# EAGLE design Keg Cop - Devel (EAGLE 9.6.2)
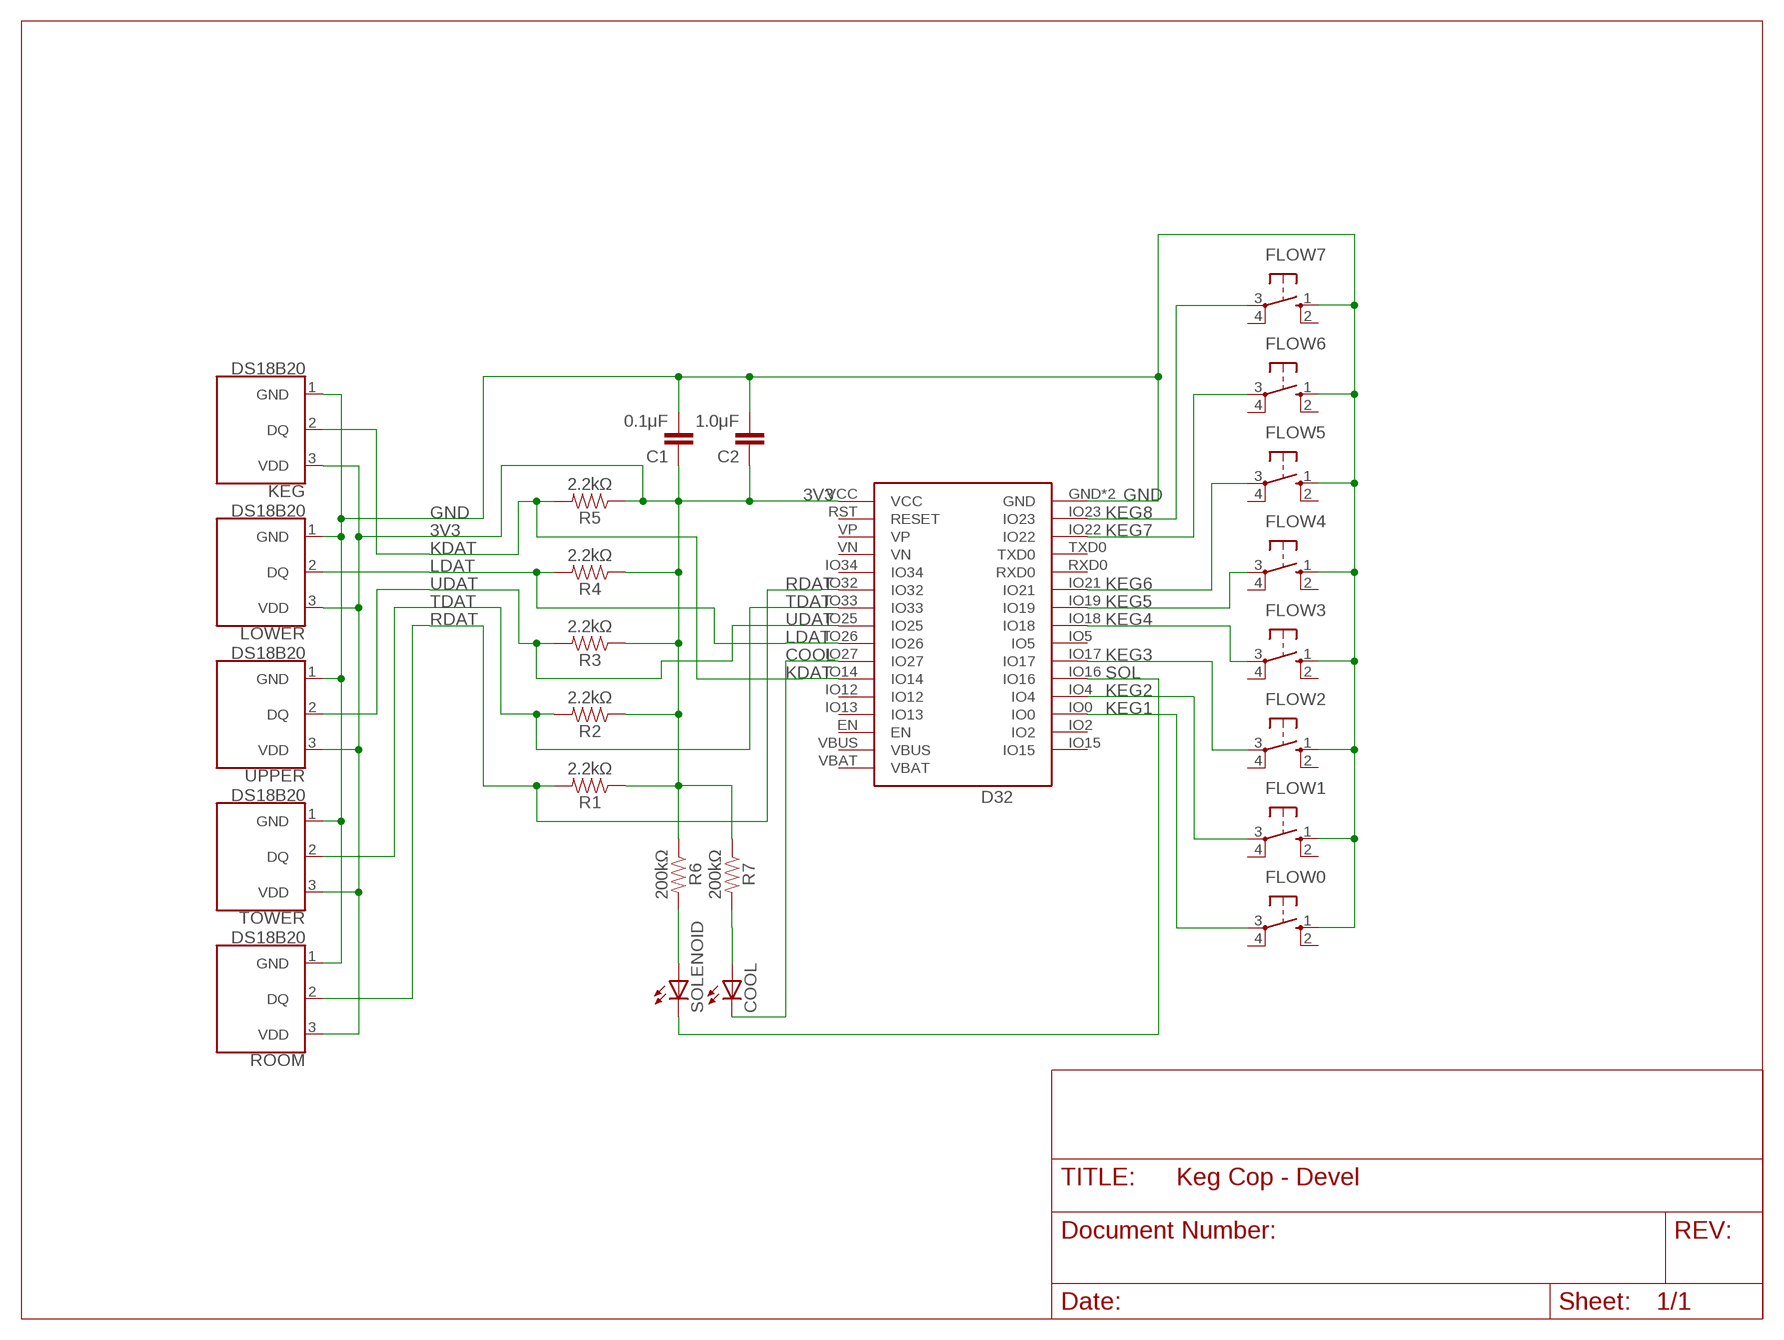
[diagram p0: schematic, sheet 1]

## Parts
C1  0.1μF  CAP_CERAMIC_2.54  [CAP_PTH-2.54]
C2  1.0μF  CAP_CERAMIC_2.54  [CAP_PTH-2.54]
COOL  LED3MM  [LED3MM]
D32  Lolin D32  WEMOS-D32D32_NO_BATT  [D32_NO_BATT]
FLOW0  10-XX  [B3F-10XX]
FLOW1  10-XX  [B3F-10XX]
FLOW2  10-XX  [B3F-10XX]
FLOW3  10-XX  [B3F-10XX]
FLOW4  10-XX  [B3F-10XX]
FLOW5  10-XX  [B3F-10XX]
FLOW6  10-XX  [B3F-10XX]
FLOW7  10-XX  [B3F-10XX]
KEG  DS18B20  [TO-92-AMMO]
LOWER  DS18B20  [TO-92-AMMO]
R1  2.2kΩ  RESISTORAXIAL-0.3  [AXIAL-0.3]
R2  2.2kΩ  RESISTORAXIAL-0.3  [AXIAL-0.3]
R3  2.2kΩ  RESISTORAXIAL-0.3  [AXIAL-0.3]
R4  2.2kΩ  RESISTORAXIAL-0.3  [AXIAL-0.3]
R5  2.2kΩ  RESISTORAXIAL-0.3  [AXIAL-0.3]
R6  200kΩ  RESISTORAXIAL-0.3  [AXIAL-0.3]
R7  200kΩ  RESISTORAXIAL-0.3  [AXIAL-0.3]
ROOM  DS18B20  [TO-92-AMMO]
SOLENOID  LED3MM  [LED3MM]
TOWER  DS18B20  [TO-92-AMMO]
UPPER  DS18B20  [TO-92-AMMO]

## Nets
3V3 [3v]: C1.1 C2.1 D32.VCC KEG.3(VDD) LOWER.3(VDD) R1.P$1 R2.P$1 R3.P$1 R4.P$1 R5.P$1 R6.P$1 R7.P$1 ROOM.3(VDD) TOWER.3(VDD) UPPER.3(VDD)
COOL: COOL.K(C) D32.IO27
GND: C1.2 C2.2 D32.GND D32.GND2(GND) FLOW0.1(S) FLOW1.1(S) FLOW2.1(S) FLOW3.1(S) FLOW4.1(S) FLOW5.1(S) FLOW6.1(S) FLOW7.1(S) KEG.1(GND) LOWER.1(GND) ROOM.1(GND) TOWER.1(GND) UPPER.1(GND)
KDAT: D32.IO14 KEG.2(DQ) R5.P$2
KEG1: D32.IO0 FLOW0.3(P)
KEG2: D32.IO4 FLOW1.3(P)
KEG3: D32.IO17 FLOW2.3(P)
KEG4: D32.IO18 FLOW3.3(P)
KEG5: D32.IO19 FLOW4.3(P)
KEG6: D32.IO21 FLOW5.3(P)
KEG7: D32.IO22 FLOW6.3(P)
KEG8: D32.IO23 FLOW7.3(P)
LDAT: D32.IO26 LOWER.2(DQ) R4.P$2
N$1: COOL.A R7.P$2
N$2: R6.P$2 SOLENOID.A
RDAT: D32.IO32 R1.P$2 ROOM.2(DQ)
SOL: D32.IO16 SOLENOID.K(C)
TDAT: D32.IO33 R2.P$2 TOWER.2(DQ)
UDAT: D32.IO25 R3.P$2 UPPER.2(DQ)
Unconnected: D32.EN D32.IO2 D32.IO5 D32.IO12 D32.IO13 D32.IO15 D32.IO34 D32.RST(RESET) D32.RXD0 D32.TXD0 D32.VBAT D32.VBUS D32.VN D32.VP FLOW0.2(S1) FLOW0.4(P1) FLOW1.2(S1) FLOW1.4(P1) FLOW2.2(S1) FLOW2.4(P1) FLOW3.2(S1) FLOW3.4(P1) FLOW4.2(S1) FLOW4.4(P1) FLOW5.2(S1) FLOW5.4(P1) FLOW6.2(S1) FLOW6.4(P1) FLOW7.2(S1) FLOW7.4(P1)

## Library data of the parts
C1 C2 = Donnie:CAP_CERAMIC_2.54
COOL SOLENOID = adafruit:LED: LED OSRAM: - CHIPLED LG R971, LG N971, LY N971, LG Q971, LY Q971, LO R971, LY R971 LH N974, LH R974 LS Q976, LO Q976, LY Q976 LO Q996 - Hyper CHIPLED LW Q18S LB Q993, LB Q99A, LB R99A - SideLED LS A670, LO A670, LY A670, LG A670, LP A670 LB A673, LV A673, LT A673, LW A673 LH A674 LY A675 LS A676, LA A676, LO A676, LY A676, LW A676 LS A679, LY A679, LG A679 - Hyper Micro SIDELED® LS Y876, LA Y876, LO Y876, LY Y876 LT Y87S - SmartLED LW L88C, LW L88S LB L89C, LB L89S, LG L890 LS L89K, LO L89K, LY L89K LS L896, LA L896, LO L896, LY L896 - TOPLED LS T670, LO T670, LY T670, LG T670, LP T670 LSG T670, LSP T670, LSY T670, LOP T670, LYG T670 LG T671, LOG T671, LSG T671 LB T673, LV T673, LT T673, LW T673 LH T674 LS T676, LA T676, LO T676, LY T676, LB T676, LH T676, LSB T676, LW T676 LB T67C, LV T67C, LT T67C, LS T67K, LO T67K, LY T67K, LW E67C LS E67B, LA E67B, LO E67B, LY E67B, LB E67C, LV E67C, LT E67C LW T67C LS T679, LY T679, LG T679 LS T770, LO T770, LY T770, LG T770, LP T770 LB T773, LV T773, LT T773, LW T773 LH T774 LS E675, LA E675, LY E675, LS T675 LS T776, LA T776, LO T776, LY T776, LB T776 LHGB T686 LT T68C, LB T68C - Hyper Mini TOPLED® LB M676 - Mini TOPLED Santana® LG M470 LS M47K, LO M47K, LY M47K Source: http://www.osram.convergy.de/
D32 = Donnie:WEMOS-D32: D32_REVERSE is a Reverse silkscreen for placing the Wemos D32 on the underside of the board D32_NO-KEEPOUT removes the keepout area beneath the antenna on the D32 and provides a note to avoid components and traces.
FLOW0 FLOW1-FLOW7 = switch-omron:10-XX: OMRON SWITCH; MPN: B3F-1000; OC_FARNELL: 176432; OC_NEWARK: 36M3542
KEG LOWER ROOM TOWER UPPER = SparkFun-Sensors:DS18B20: Dallas/Maxim DS18B20 1-Wire Temperature Sensor The DS18B20 reports degrees C with 9 to 12-bit precision, -55C to 125C (+/-0.5C). Each sensor has a unique 64-Bit Serial number etched into it - allows for a huge number of sensors to be used on one data bus. Datasheet <http://datasheets.maximintegrated.com/en/ds/DS18B20.pdf> SparkFun Products One Wire Digital Temperature Sensor - DS18B20 <https://www.sparkfun.com/products/245> (SEN-00245); STORE_ID: SEN-00245
R1-R7 = SparkFun-Resistors:RESISTOR: Generic Resistor Package

## Net classes
0 default: width 0.305 mm, clearance 0.305 mm
1 5v: width 0.406 mm, clearance 0.406 mm
2 3v: width 0.406 mm, clearance 0.406 mm

## Board
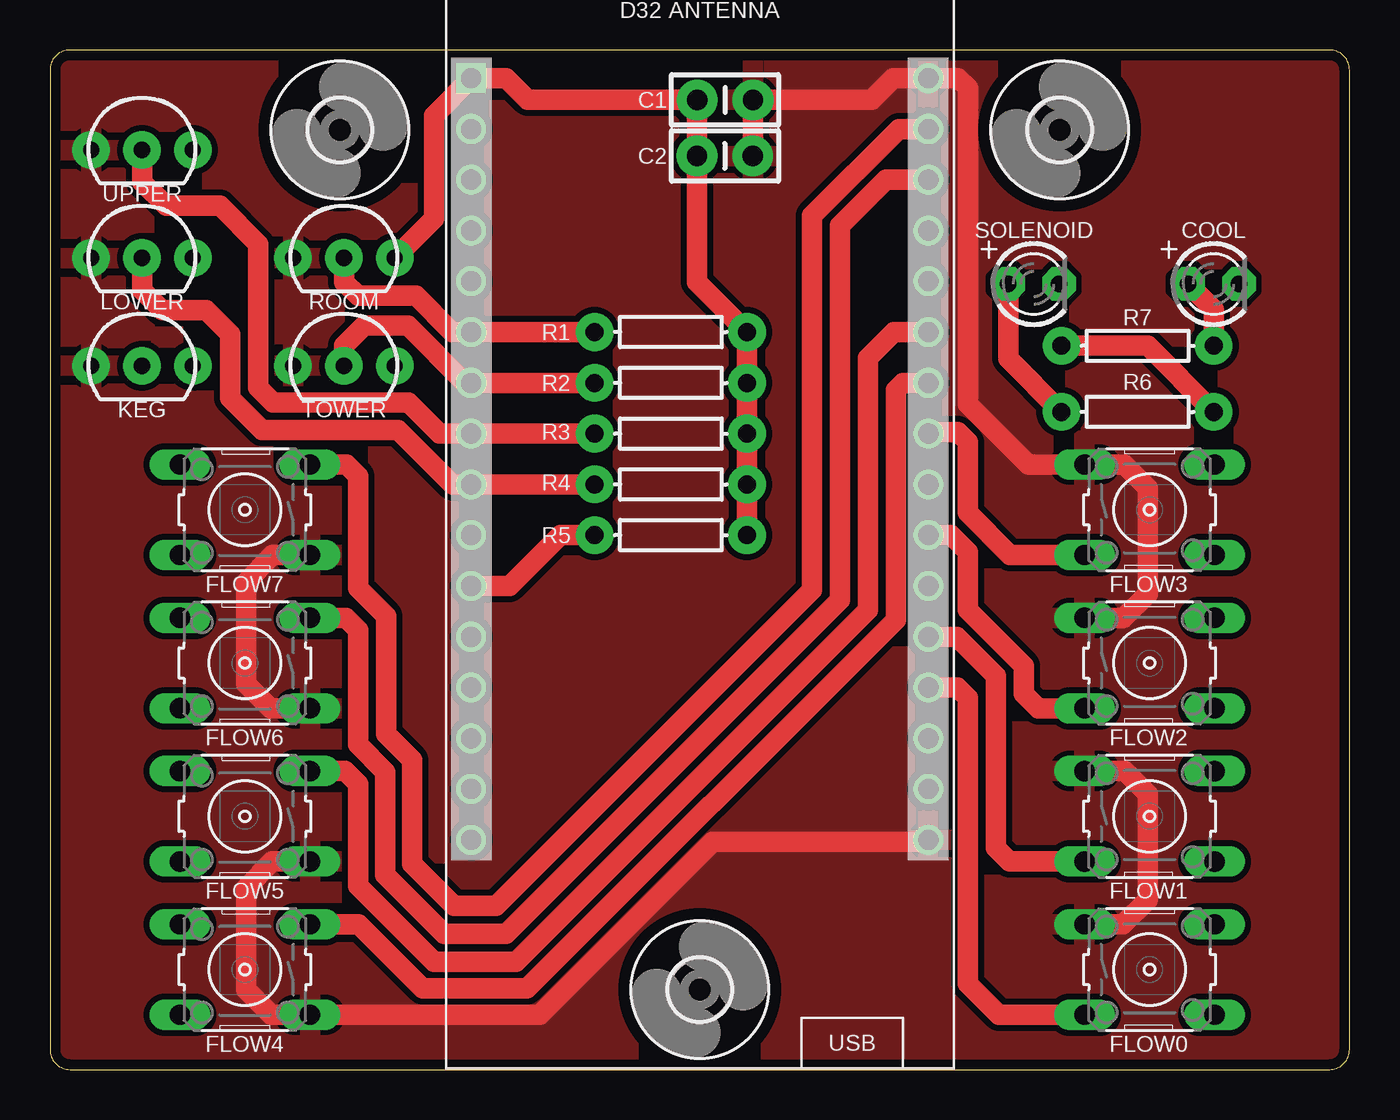
[diagram p1: board, top side]
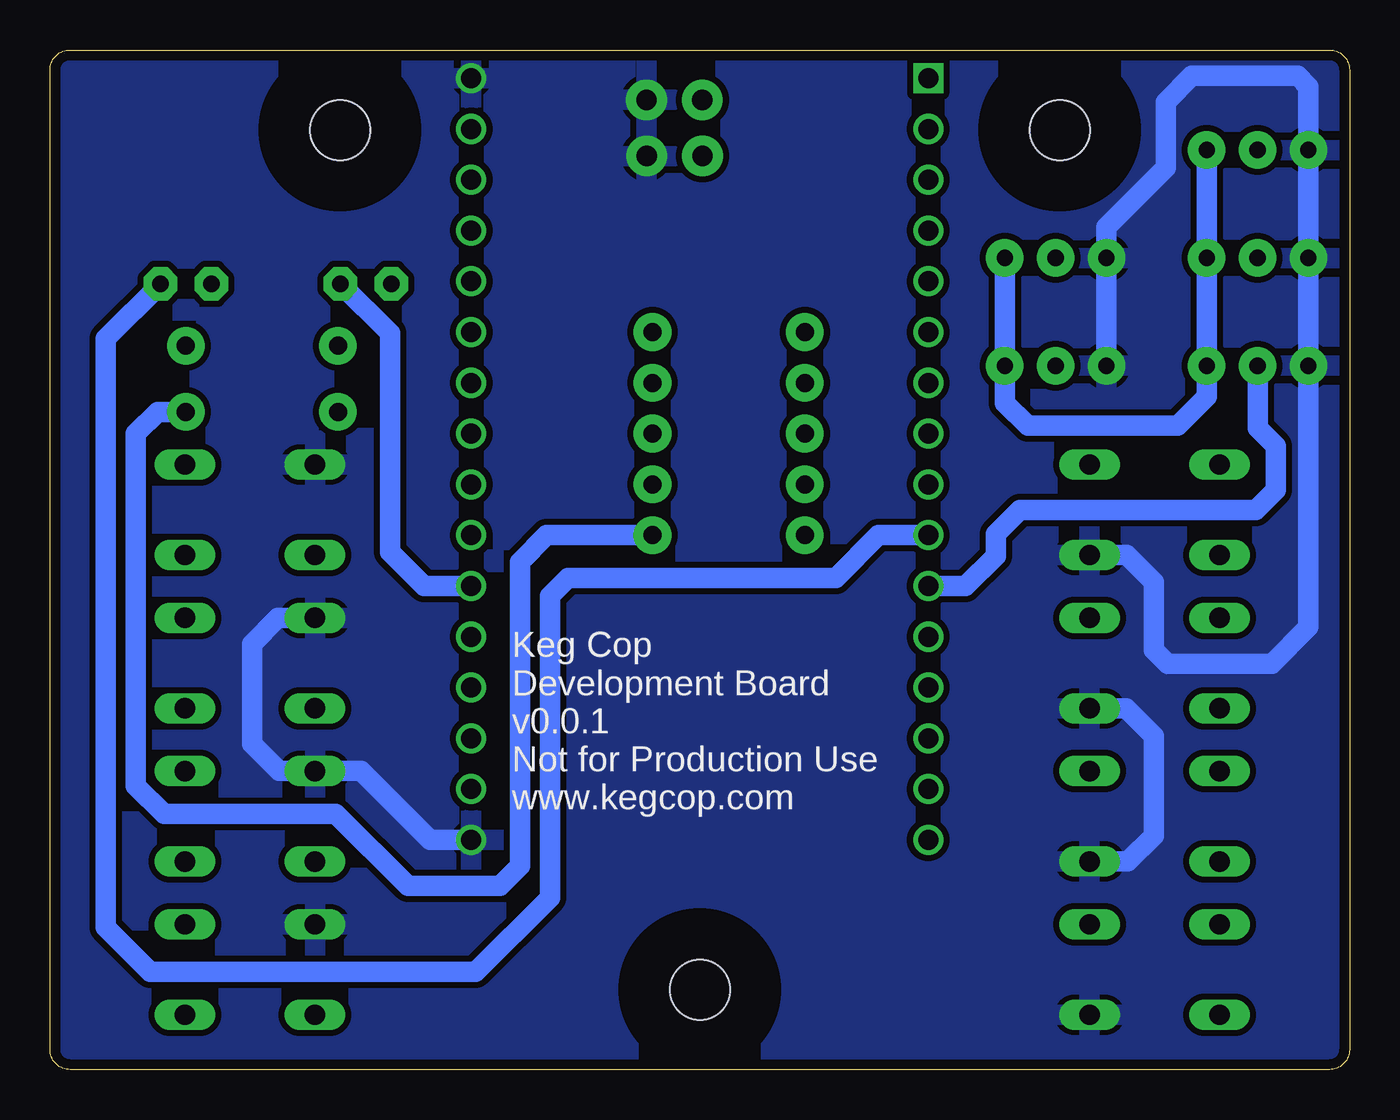
[diagram p2: board, bottom side, seen from below]

Size 65 x 51 mm. Coordinates in mm from the lower left corner, seen from the top.
Outline: 1,0 64,0 arc90 65,1 65,50 arc90 64,51 1,51 arc90 0,50 0,1 arc90 1,0
Copper layers (1*16): Top 0.035mm / dielectric 1.5mm / Bottom 0.035mm
Design rules "default *": minimum track width 6mil, minimum drill 0.35mm, track to track 6mil, track to pad 6mil, pad to pad 6mil, via to via 6mil, smd to smd 6mil, copper to edge 20mil, drill to drill 6mil, minimum pad ring 10mil, minimum via ring 8mil, stop-mask expansion 4mil, vias tented up to drill 20mil, thermal gap 10mil

### Footprints (pad centres in the part's own frame; a part is rotated, then mirrored left to right if it is on the bottom)
CAP_PTH-2.54 = drill 1.016 pad 2.032: 1 -1.397,0; 2 1.397,0
LED3MM = drill 0.813 pad 1.676 octagon: A -1.27,0; K 1.27,0
D32_NO_BATT = drill 1: EN -11.43,-12.7; GND 11.43,20.32; GND2 11.43,-17.78; IO0 11.43,-10.16; IO2 11.43,-12.7; IO4 11.43,-7.62; IO5 11.43,0; IO12 -11.43,-7.62; IO13 -11.43,-10.16; IO14 -11.43,-5.08; IO15 11.43,-15.24; IO16 11.43,-5.08; IO17 11.43,-2.54; IO18 11.43,2.54; IO19 11.43,5.08; IO21 11.43,7.62; IO22 11.43,15.24; IO23 11.43,17.78; IO25 -11.43,2.54; IO26 -11.43,0; IO27 -11.43,-2.54; IO32 -11.43,7.62; IO33 -11.43,5.08; IO34 -11.43,10.16; RST -11.43,17.78; RXD0 11.43,10.16; TXD0 11.43,12.7; VBAT -11.43,-17.78; VBUS -11.43,-15.24; VN -11.43,12.7; VP -11.43,15.24 | drill 1 square: VCC -11.43,20.32
B3F-10XX = drill 1.016 long: 1 -3.251,2.261; 2 3.251,2.261; 3 -3.251,-2.261; 4 3.251,-2.261
TO-92-AMMO = drill 0.813 pad 1.88: 1 -2.54,0; 2 0,0; 3 2.54,0
AXIAL-0.3 = drill 0.9 pad 1.88: P$1 -3.81,0; P$2 3.81,0
3,0 = hole 3: 0,0

### Placement (x,y rotation side)
C1  33.77,48.5 0 top
C2  33.76,45.7 0 top
COOL  58.2,39.3 0 top
D32  32.5,29.27 0 top
FLOW0  55,5 0 top
FLOW1  55,12.67 0 top
FLOW2  55,20.33 0 top
FLOW3  55,28 0 top
FLOW4  9.75,5 180 top
FLOW5  9.75,12.67 180 top
FLOW6  9.75,20.33 180 top
FLOW7  9.75,28 180 top
KEG  4.6,35.2 0 top
LOWER  4.6,40.6 0 top
R1  31.05,36.89 180 top
R2  31.05,34.35 180 top
R3  31.05,31.81 180 top
R4  31.05,29.27 180 top
R5  31.05,26.73 180 top
R6  54.4,32.9 180 top
R7  54.4,36.2 0 top
ROOM  14.7,40.6 0 top
SOLENOID  49.2,39.3 0 top
TOWER  14.7,35.2 0 top
U$1  [3,0]  50.5,47 0 top
U$2  [3,0]  14.5,47 0 top
U$3  [3,0]  32.5,4 0 top
UPPER  4.6,46 0 top

### Tracks (layer width: path | path; a pad name or v marks a point on that pad's centre or on a via)
3V3
  Top 1.016: R5.P$1 R4.P$1 R3.P$1 R2.P$1 R1.P$1 32.36,39.39 C2.1 C1.1 23.9,48.5 22.81,49.59 D32.VCC 19.2,47.72 19.2,42.56 ROOM.3 | R7.P$1 54.91,36.2 R6.P$1
  Bottom 1.016: R5.P$1 40.17,26.73 41.5,25.4 41.5,10.2 42.5,9.2 47.1,9.2 50.7,12.8 59.3,12.8 60.7,14.2 60.7,31.81 59.61,32.9 R6.P$1 | UPPER.3 LOWER.3 KEG.3 7.14,33.66 8.6,32.2 16.1,32.2 17.24,33.34 TOWER.3 ROOM.3
COOL
  Bottom 1.016: D32.IO27 23.57,26.73 25.7,24.6 39.1,24.6 40,23.7 40,8.6 43.7,4.9 59.98,4.9 62.2,7.12 62.2,36.57 COOL.K
GND
  Top 1.016: C2.2 C1.2 41.1,48.5 42.19,49.59 D32.GND 45.41,49.59 45.9,49.1 45.9,33.3 48.94,30.26 FLOW3.1 53.74,30.26 54.9,29.1 54.9,23.8 53.69,22.59 FLOW2.1 | D32.GND2 43.83,11.39 33.13,11.39 24.48,2.74 FLOW4.1 11.06,2.74 9.8,4 9.8,9.1 11.11,10.41 FLOW5.1 | FLOW7.1 11.14,25.74 9.8,24.4 9.8,19.3 11.03,18.07 FLOW6.1 | FLOW0.1 53.66,7.26 54.9,8.5 54.9,13.8 53.77,14.93 FLOW1.1
  Bottom 0.406: 2.06,40.4 LOWER.1
  Bottom 1.016: FLOW5.1 11.09,10.41 9.8,11.7 9.8,16.7 11.17,18.07 FLOW6.1 | FLOW2.1 53.61,22.59 54.9,21.3 54.9,16.3 53.53,14.93 FLOW1.1 49.43,14.93 45.99,11.49 D32.GND2 | TOWER.1 ROOM.1 12.16,42.14 9.2,45.1 9.2,48.4 7.9,49.7 2.6,49.7 2.06,49.16 UPPER.1 2.06,40.4 KEG.1 2.06,22.14 3.9,20.3 9.1,20.3 9.8,21 9.8,24.4 11.14,25.74 FLOW7.1
  pour Top: 65.4,51.2 65.4,-0.1 -0.2,-0.1 -0.2,51.2
  pour Bottom: -0.2,51.3 -0.2,-0.3 65.2,-0.3 65.2,51.3
KDAT
  Top 1.016: D32.IO14 22.99,24.19 25.53,26.73 R5.P$2
  Bottom 1.016: D32.IO14 19.21,24.19 17.7,25.7 17.7,26.8 16.5,28 4.7,28 3.7,29 3.7,31.2 4.6,32.1 KEG.2
KEG1
  Top 1.016: D32.IO0 45.39,19.11 45.9,18.6 45.9,4.3 47.46,2.74 FLOW0.3
KEG2
  Top 1.016: D32.IO4 45.35,21.65 47.3,19.7 47.3,11.1 47.99,10.41 FLOW1.3
KEG3
  Top 1.016: D32.IO17 45.07,26.73 45.9,25.9 45.9,23 48.7,20.2 48.7,18.8 49.43,18.07 FLOW2.3
KEG4
  Top 0.305: 44.02,31.9 D32.IO18
  Top 1.016: FLOW3.3 48.02,25.74 45.9,27.86 45.9,31.4 45.4,31.9 44.02,31.9
KEG5
  Top 1.016: D32.IO19 42.65,34.35 42.3,34 42.3,22.5 23.86,4.06 18.64,4.06 15.44,7.26 FLOW4.3
KEG6
  Top 0.305: D32.IO21
  Top 1.016: FLOW5.3 14.77,14.93 15.4,14.3 15.4,9.2 19.2,5.4 23.3,5.4 40.9,23 40.9,35.6 42.2,36.9 D32.IO21
KEG7
  Top 1.016: FLOW6.3 14.81,22.59 15.4,22 15.4,16.27 16.77,14.9 16.77,9.73 19.7,6.8 22.8,6.8 39.5,23.5 39.5,42.2 41.81,44.51 D32.IO22
KEG8
  Top 1.016: D32.IO23 42.45,47.05 38.1,42.7 38.1,24 22.3,8.2 20.2,8.2 18.11,10.29 18.11,15.49 16.8,16.8 16.8,22.7 15.4,24.1 15.4,29.7 14.84,30.26 FLOW7.3
LDAT
  Top 1.016: R4.P$2 20.9,29.27 D32.IO26 20.13,29.27 17.4,32 10.6,32 9,33.6 9,36.8 7.8,38 5.6,38 4.6,39 LOWER.2
N$1
  Top 1.016: R7.P$2 58.21,38.02 COOL.A
N$2
  Top 1.016: R6.P$2 47.93,35.56 SOLENOID.A
RDAT
  Top 1.016: R1.P$2 21.18,36.89 | 21.18,36.89 D32.IO32 | 21.18,36.89 20.11,36.89 18.3,38.7 15.4,38.7 14.7,39.4 ROOM.2
SOL
  Bottom 1.016: D32.IO16 46.29,24.19 48,25.9 48,35.7 48,36.83 SOLENOID.K
TDAT
  Top 1.016: R2.P$2 21.18,34.35 D32.IO33 20.75,34.35 17.9,37.2 15.7,37.2 14.7,36.2 TOWER.2
UDAT
  Top 1.016: R3.P$2 21.18,31.81 D32.IO25 19.49,31.81 17.95,33.35 11.16,33.35 10.4,34.11 10.4,41.3 8.5,43.2 5.8,43.2 4.6,44.4 UPPER.2

### Text on the board
bNames: Keg Cop / Development Board / v0.0.1 / Not for Production Use / www.kegcop.com